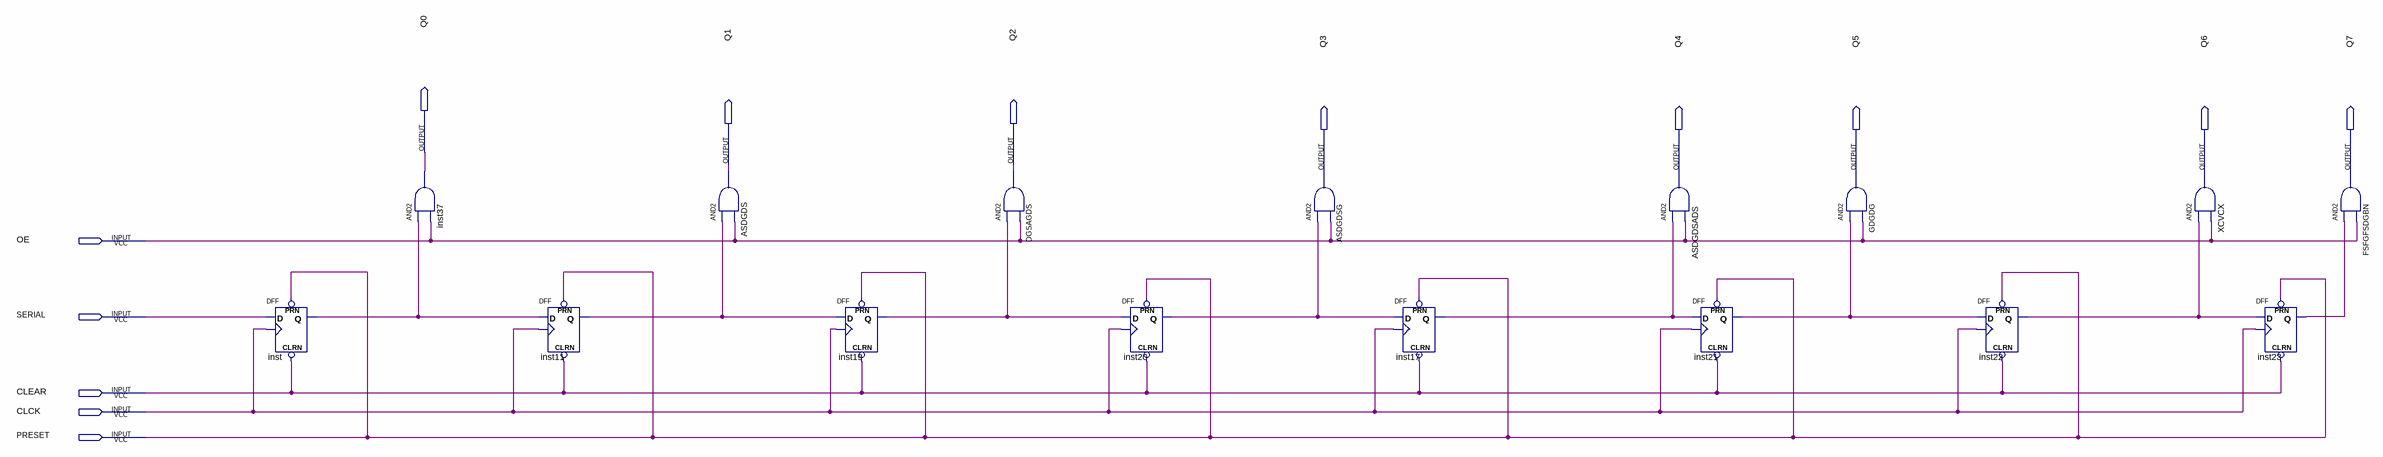
[diagram p0: schematic sheet]
// Quartus schematic SIPO8BITS.bdf as structural Verilog: 16 symbols, 13 pins
module SIPO8BITS (
  input  OE,
  input  SERIAL,
  input  CLEAR,
  input  CLCK,
  input  PRESET,
  output Q0,
  output Q1,
  output Q2,
  output Q3,
  output Q4,
  output Q5,
  output Q6,
  output Q7
);

  wire inst11_q, inst17_q, inst19_q, inst20_q, inst21_q, inst22_q, inst23_q, inst_q;

  DFF inst (.CLRN(CLEAR), .CLK(CLCK), .D(SERIAL), .PRN(PRESET), .Q(inst_q));
  and inst37 (Q0, inst_q, OE);
  DFF inst11 (.CLRN(CLEAR), .CLK(CLCK), .D(inst_q), .PRN(PRESET), .Q(inst11_q));
  and ASDGDS (Q1, inst11_q, OE);
  DFF inst19 (.CLRN(CLEAR), .CLK(CLCK), .D(inst11_q), .PRN(PRESET), .Q(inst19_q));
  and DGSAGDS (Q2, inst19_q, OE);
  DFF inst20 (.CLRN(CLEAR), .CLK(CLCK), .D(inst19_q), .PRN(PRESET), .Q(inst20_q));
  and ASDGDSG (Q3, inst20_q, OE);
  DFF inst17 (.CLRN(CLEAR), .CLK(CLCK), .D(inst20_q), .PRN(PRESET), .Q(inst17_q));
  and ASDGDSADS (Q4, inst17_q, OE);
  DFF inst21 (.CLRN(CLEAR), .CLK(CLCK), .D(inst17_q), .PRN(PRESET), .Q(inst21_q));
  and GDGDG (Q5, inst21_q, OE);
  DFF inst22 (.CLRN(CLEAR), .CLK(CLCK), .D(inst21_q), .PRN(PRESET), .Q(inst22_q));
  and XCVCX (Q6, inst22_q, OE);
  DFF inst23 (.CLRN(CLEAR), .CLK(CLCK), .D(inst22_q), .PRN(PRESET), .Q(inst23_q));
  and FSFGFSDGBN (Q7, inst23_q, OE);
endmodule
